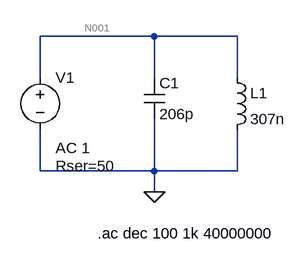
[diagram p0: schematic Circuito resonante.asc]
Circuito resonante.asc, the LTspice schematic file:
Version 4
SHEET 1 880 680
WIRE 224 48 48 48
WIRE 352 48 224 48
WIRE 48 112 48 48
WIRE 224 112 224 48
WIRE 352 112 352 48
WIRE 48 256 48 192
WIRE 224 256 224 176
WIRE 224 256 48 256
WIRE 352 256 352 192
WIRE 352 256 224 256
WIRE 224 288 224 256
FLAG 224 288 0
SYMBOL voltage 48 96 R0
WINDOW 123 24 124 Left 2
WINDOW 39 24 152 Left 2
SYMATTR Value2 AC 1
SYMATTR SpiceLine Rser=50
SYMATTR InstName V1
SYMATTR Value ""
SYMBOL cap 208 112 R0
SYMATTR InstName C1
SYMATTR Value 206p
SYMBOL ind 336 96 R0
SYMATTR InstName L1
SYMATTR Value 307n
TEXT 136 352 Left 2 !.ac dec 100 1k 40000000

The netlist it stands for:
* Circuito resonante.asc
V1 N001 0 AC 1 Rser=50
C1 N001 0 206p
L1 N001 0 307n
.ac dec 100 1k 40000000
.backanno
.end

* Results of the author's LTspice run, read from the files saved beside the schematic
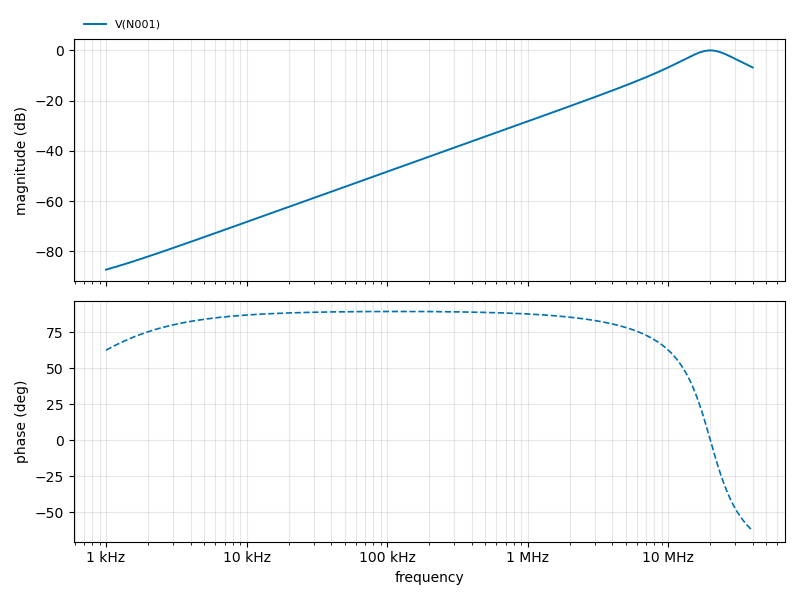
[diagram p1: AC Analysis of Circuito resonante.asc, plotted from the saved traces]
* AC Analysis, 1 run:
*   V(N001): -87.24 dB at 1 kHz, -6.78 dB at 40 MHz, peak -0.00 dB at 19.95 MHz, 3 dB below the peak at 13.73 MHz and 29.18 MHz